# Altium schematic sheet Sheet1.SchDoc
size A4
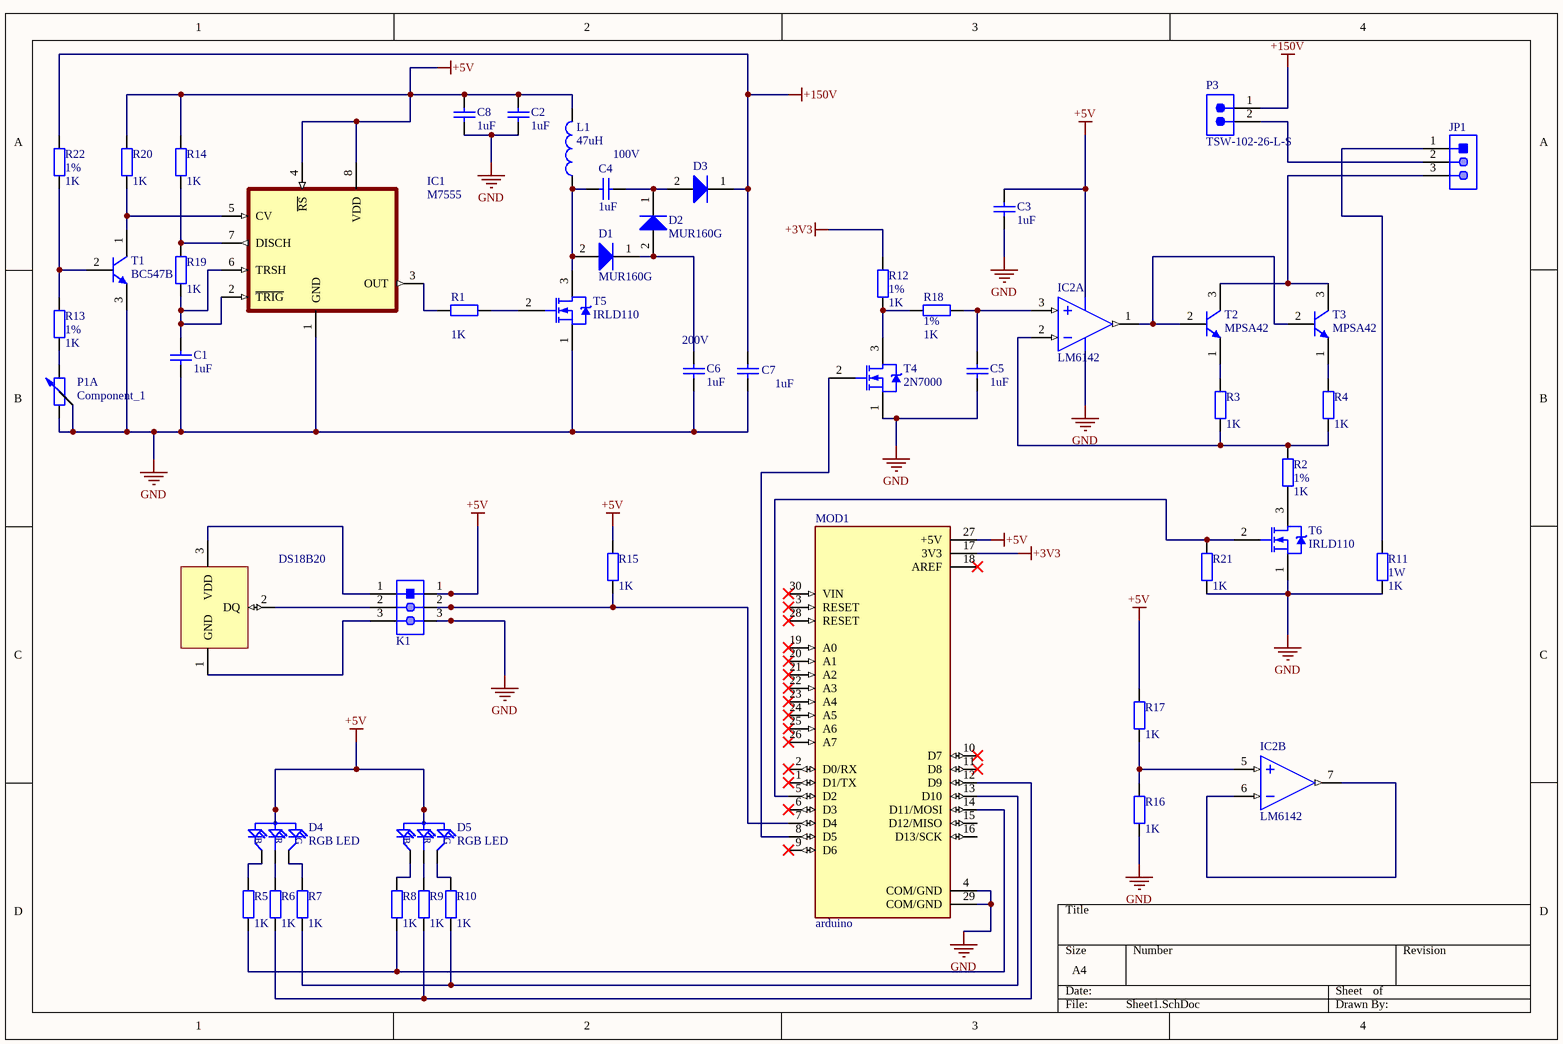
[diagram p0: Sheet1.SchDoc]

## Parts
C1  value 1uF  [RAD-0.3]  (hidden comment: Cap)
C2  value 1uF  [RAD-0.3]  (hidden comment: Cap)
C3  value 1uF  [RAD-0.3]  (hidden comment: Cap)
C4  100V  value 1uF  [Ceramic Capacitor]
C5  value 1uF  [RAD-0.3]  (hidden comment: Cap)
C6  200V  value 1uF  [electrolytic capacitor 2.2uf]
C7  value 1uF  [electrolytic capacitor 2.2uf]  (hidden comment: 200V)
C8  value 1uF  [RAD-0.3]  (hidden comment: Cap)
D1  MUR160G  [MUR160G]
D2  MUR160G  [MUR160G]
D3  MUR160G  [MUR160G]  (value not drawn)
D4  RGB LED
D5  RGB LED
DS18B20  DS18B20+  [Q3+1]  (value not drawn)
IC1  M7555  [M7555]
IC2  LM6142  [LM6142]  (parts A,B of 2)
JP1  22-28-4033  [MOLX-22-28-4033_V]  (value not drawn)
K1  61900319521  [K1]  (value not drawn)
L1  value 47uH  [ELC08D470E]  (hidden comment: Inductor)
MOD1  arduino
P1  Component_1  (part A of 2)
P3  TSW-102-26-L-S  [SMTC-TSW-102-26-XX-S]
R1  value 1K  [Resistor]  (hidden comment: 1%)
R2  1%  value 1K  [SMD resistor]
R3  value 1K  [SMD resistor]  (hidden comment: Res2)
R4  value 1K  [SMD resistor]  (hidden comment: Res2)
R5  value 1K  [Resistor]  (hidden comment: Res2)
R6  value 1K  [Resistor]  (hidden comment: Res2)
R7  value 1K  [Resistor]  (hidden comment: Res2)
R8  value 1K  [Resistor]  (hidden comment: Res2)
R9  value 1K  [Resistor]  (hidden comment: Res2)
R10  value 1K  [Resistor]  (hidden comment: Res2)
R11  1W  value 1K  [RESISTOR 1W]
R12  1%  value 1K  [SMD resistor]
R13  1%  value 1K  [Resistor]
R14  value 1K  [Resistor]  (hidden comment: Res2)
R15  value 1K  [Resistor]  (hidden comment: Res2)
R16  value 1K  [SMD resistor]  (hidden comment: 1%)
R17  value 1K  [SMD resistor]  (hidden comment: 1%)
R18  1%  value 1K  [SMD resistor]
R19  value 1K  [Resistor]  (hidden comment: Res2)
R20  value 1K  [Resistor]  (hidden comment: Res2)
R21  value 1K  [SMD resistor]  (hidden comment: 1%)
R22  1%  value 1K  [Resistor]
T1  BC547B  [BC547B]
T2  MPSA42  [BC547B]
T3  MPSA42  [BC547B]
T4  2N7000  [BC547B]
T5  IRLD110
T6  IRLD110

## Nets
+3V3: MOD1.17(3V3) R12.2
+5V: C2.2 C3.2 C8.2 D4.C(POS) D5.C(POS) IC1.4(~{RS}) IC1.8(VDD) K1.1 L1.2 MOD1.27(+5V) R14.2 R15.2 R17.2 R20.2
+150V: C7.2 D3.1(K) P3.1 R22.2
GND: C1.1 C2.1 C3.1 C5.1 C6.1 C7.1 C8.1 IC1.1(GND) K1.3 MOD1.4(COM/GND) MOD1.29(COM/GND) P1.1 P1.3 R11.1 R16.1 R21.1 T1.3(E) T4.1(S) T5.1(S) T6.1(S)
NetC1_2: C1.2 IC1.2(~{TRIG}) IC1.6(TRSH) R19.1
NetC4_1: C4.1 D2.1(K) D3.2(A)
NetC4_2: C4.2 D1.2(A) L1.1 T5.3(D)
NetC5_2: C5.2 IC2.3(INA+) R18.2
NetC6_2: C6.2 D1.1(K) D2.2(A)
NetD4_B: D4.B R5.2
NetD4_G: D4.G R7.2
NetD4_R: D4.R R6.2
NetD5_B: D5.B R8.2
NetD5_G: D5.G R10.2
NetD5_R: D5.R R9.2
NetDS18B20_1: DS18B20.1(GND) K1.3
NetDS18B20_2: DS18B20.2(DQ) K1.2
NetDS18B20_3: DS18B20.3(VDD) K1.1
NetIC1_3: IC1.3(OUT) R1.1
NetIC1_5: IC1.5(CV) R20.1 T1.1(C)
NetIC1_7: IC1.7(DISCH) R14.1 R19.2
NetIC2_1: IC2.1(OUTA) T2.2(B) T3.2(B)
NetIC2_2: IC2.2(INA-) R2.2 R3.1 R4.1
NetIC2_5: IC2.5(INB+) R16.2 R17.1
NetIC2_6: IC2.6(INB-) IC2.7(OUTB)
NetJP1_1: JP1.1 R11.2
NetJP1_2: JP1.2 P3.2
NetJP1_3: JP1.3 T2.3(C) T3.3(C)
NetK1_2: K1.2 MOD1.7(D4) R15.1
NetMOD1_5: MOD1.5(D2) R21.2 T6.2(G)
NetMOD1_8: MOD1.8(D5) T4.2(G)
NetMOD1_12: MOD1.12(D9) R6.1 R9.1
NetMOD1_13: MOD1.13(D10) R7.1 R10.1
NetMOD1_14: MOD1.14(D11/MOSI) R5.1 R8.1
NetP1_2: P1.2 R13.1
NetR1_2: R1.2 T5.2(G)
NetR2_1: R2.1 T6.3(D)
NetR3_2: R3.2 T2.1(E)
NetR4_2: R4.2 T3.1(E)
NetR12_1: R12.1 R18.1 T4.3(D)
NetR13_2: R13.2 R22.1 T1.2(B)

Not connected (* = marked no-connect by the designer): MOD1 1(D1/TX)* 2(D0/RX)* 3(RESET)* 6(D3)* 9(D6)* 10(D7)* 11(D8)* 15(D12/MISO) 16(D13/SCK) 18(AREF)* 19(A0)* 20(A1)* 21(A2)* 22(A3)* 23(A4)* 24(A5)* 25(A6)* 26(A7)* 28(RESET)* 30(VIN)*

## Library data of the parts
C1-C5 C8 = Capacitor: Published: 8-Jun-2000; LatestRevisionDate: 17-Jul-2002; LatestRevisionNote: Re-released for DXP Platform.; PackageReference: RAD-0.3; Publisher: Altium Limited; PackageDescription: Radial Cap, Thru-Hole; 2 Leads; 0.3 in Pin Spacing
C6 C7 = C1uF: Capacitor; Published: 8-Jun-2000; LatestRevisionDate: 17-Jul-2002; LatestRevisionNote: Re-released for DXP Platform.; PackageReference: RAD-0.3; Publisher: Altium Limited; PackageDescription: Radial Cap, Thru-Hole; 2 Leads; 0.3 in Pin Spacing
D1-D3 = Diode: Manufacturer: ON Semiconductor; Packing: Bulk Bag; IFSM Max (A): 35; VRRM Max (V): 600; Type: Ultrafast; PackageVersion: Rev. U, 02/2005; PackageDescription: 2-Pin, Axial Lead, Diameter 2.35 mm; RoHS: TRUE; ComponentLink3Description: Package Specification; ComponentLink3URL: http://www.onsemi.cn/pub_link/Collateral/59-10.PDF; ComponentLink1URL: http://www.onsemi.com/; ComponentLink1Description: Manufacturer URL; ComponentLink2Description: Datasheet; ComponentLink2URL: http://www.onsemi.com/pub_link/Collateral/MUR120-D.PDF; PackageReference: AXIAL_LEAD-2-59-10; Mounting Technology: Through Hole; PartNumber: MUR160G; DatasheetVersion: Rev. 12; Manufacturer Part Number: MUR160G
DS18B20 = DS18B20+: IC; Manufacturer: Maxim; ComponentLink2URL: http://datasheets.maxim-ic.com/en/ds/DS18B20.pdf; PackageReference: Q3+1; ComponentLink1Description: Manufacturer URL; PackageDescription: TO-92 Package, Body Dia. 4.7mm; Leads 0.51 x 0.51 mm (max), Pb-Free; DatasheetVersion: 2007; Code_JEDEC: TO-226-AA; ComponentLink1URL: http://www.maxim-ic.com; PackageVersion: revB, 2009; ComponentLink2Description: Datasheet; Manufacturer Part Number: DS18B20+
IC1 = M7555: IC; Manufacturer: Intersil; Manufacturer Part Number: ICM7555CBAZ-T; MF: Renesas Electronics; MP: ICM7555CBAZ; Frequency: 1MHz; Operating Supply Current: 60uA; Min Supply Voltage: 2V; Number of Timers/Counters: 1; High Level Output Current: -800uA; Low Level Output Current: 20mA; Max Supply Voltage: 18V; Package: SOIC-8 Intersil; Price: None; SnapEDA_Link: https://www.snapeda.com/parts/ICM7555CBAZ/Renesas%20Electronics%20America%20Inc./view-part/931/?ref=snap; Availability: Unavailable; Value: *; Supplier 1: Avnet; Supplier Part Number 1: ICM7555CBAZ-T; RoHS: Yes; Category: Clock and Timing; Pricing 1: 2500=0,25401, 5000=0,24643, 10000=0,23930, 15000=0,23256, 25000=0,22947 (USD); Mount: Surface Mount; Case/Package: SOIC; Number of Pins: 8; Contact Plating: Tin,Matte; Min Operating Temperature: 0°C; Max Operating Temperature: 70°C; Packaging: Tape and Reel; Package Quantity: 2500; Radiation Hardening: No; Lead Free: Lead Free; ComponentLink1URL: https://datasheet.ciiva.com/6667/fn2867-6667943.pdf?src-supplier=Digi-Key; ComponentLink1Description: https://datasheet.ciiva.com/6667/fn2867-6667943.pdf?src-supplier=Digi-Key; ComponentLink2URL: https://datasheet.ciiva.com/6667/fn2867-6667945.pdf?src-supplier=Digi-Key; ComponentLink2Description: https://datasheet.ciiva.com/6667/fn2867-6667945.pdf?src-supplier=Digi-Key; ComponentLink3URL: https://datasheet.ciiva.com/6667/fn2867-6667947.pdf?src-supplier=Digi-Key; ComponentLink3Description: https://datasheet.ciiva.com/6667/fn2867-6667947.pdf?src-supplier=Digi-Key
IC2 = LM6412: IC; Manufacturer: TI National Semiconductor; Manufacturer Part Number: LM6142AIM; PowerWise: N; CompType: Amplifiers; PackageTopMarking: NSZXTT*LM614*2AIM; PinCount: 8; Package Reference: D0008A; Code_IPC: SOIC127P600-8; PackageDescription: SOIC Narrow, 4.9 x 3.9 x 1.45mm, 8 Lead, 1.27mm Pitch; ComponentLink1URL: http://www.ti.com/general/docs/lit/getliterature.tsp?genericPartNumber=LM6142&fileType=pdf; Code_JEDEC: MS-012-AA; RoHS: N; ComponentLink1Description: Datasheet URL
JP1 = CMP-1676-00001-5: Male Header, Pitch 2.54 mm, 1 x 3 Position, Height 8.38 mm, Tail Length 3.18 mm, RoHS, Bulk; Manufacturer: Molex; Rows: 1; Voltage Rating: 250 V; Current Rating: 4 A; Min Operating Temperature: 0 degC; Lead Pitch: 0.1 inch; Packaging: Bulk; Contact Finish: Gold; RoHSCompliant: true; Contact Material: Brass; PackageReference: 22-28-4033; REACH SVHC: Unknown; PackageDescription: Male Header, Pitch 2.54 mm, 1 x 3 Position, Height 8.38 mm, Tail Length 3.18 mm; ComponentLink2URL: http://www.molex.com/pdm_docs/sd/022284033_sd.pdf; Height: 8.38 mm; Mounting Technology: Through Hole; ComponentLink1Description: Manufacturer URL; Length: 7.62 mm; Mount: Through Hole; DatasheetVersion: Rev. G, 01/2012; Max Operating Temperature: 75 degC; ComponentLink2Description: Datasheet; Colour: Black; Pins: 3; Contact Plating: Gold; Package Quantity: 1; ComponentLink1URL: http://www.molex.com/
K1 = K1: Connector; Manufacturer: Wurth Electronics; Working Voltage: 250VAC; Pitch: 2.54mm; Position: 1x3; Gender: Male; Contact Resistance: 20mOhm; Package Reference: 61900319521; Manufacturer URL: http://www.we-online.de; Orientation: RightAngled; Operating Temperature: -40to105degC; Publisher: WurthElektronik; Packaging: Bag; Datasheet URL: https://katalog.we-online.de/em/datasheet/6190xx19521.pdf; Mounting Technology: THT; Part Number: 61900319521; Manufacturer Part Number: 61900319521
L1 = Inductor: Code_IEC: 1005; Published: 8-Jun-2000; LatestRevisionDate: 29-May-2009; LatestRevisionNote: IPC-7351 Footprint Added.; PackageReference: 0402-A; Publisher: Altium Limited; PackageDescription: Chip Inductor; Code_JEITA: 0402
MOD1 = arduino: Arduino nano
P3 = CMP-1024-00330-1: 0.025" SQ Post Header, Through-hole, Vertical, -55 to 125 degC, 2.54 mm Pitch, 2-Pin, Male, RoHS; Manufacturer: Samtec; Pitch: 2.54 mm; DatasheetVersion: F-214; PackageReference: TSW-102-26-XX-S; ComponentLink3Description: Package Specification; PackageDescription: .025[0.64] SQ. Post Terminal Strip Assembly; PackageVersion: DM, 8/1988; ComponentLink1Description: Manufacturer URL; ComponentLink2URL: http://www.samtec.com/documents/webfiles/pdf/TSW_TH.PDF; ComponentLink3URL: http://www.samtec.com/documents/webfiles/cpdf/TSW-XXX-XX-XXX-X-XX-XXX-MKT.pdf; ComponentLink2Description: Datasheet; Temperature Range: -55 to 125 degC; Mounting Technology: Through-hole; ComponentLink1URL: http://www.samtec.com; RoHS: True; PartNumber: TSW-102-26-L-S; Orientation: Vertical
R1 R11 R12 R16-R18 R21 R22 = Resistor: Published: 8-Jun-2000; LatestRevisionDate: 17-Jul-2002; LatestRevisionNote: Re-released for DXP Platform.; PackageReference: AXIAL-0.4; Publisher: Altium Limited; PackageDescription: Axial Device, Thru-Hole; 2 Leads; 0.4 in Pin Spacing
R2-R10 R13-R15 R19 R20 = Res2: Resistor; Published: 8-Jun-2000; LatestRevisionDate: 17-Jul-2002; LatestRevisionNote: Re-released for DXP Platform.; PackageReference: AXIAL-0.4; Publisher: Altium Limited; PackageDescription: Axial Device, Thru-Hole; 2 Leads; 0.4 in Pin Spacing
T1 = BC547B: Transistor; Manufacturer: ON Semiconductor / Fairchild; Polarity: NPN; Packing: Bulk Box; IC Continuous (A): 0.1; fT Min (MHz): 150; DatasheetVersion: Rev. 7; ComponentLink1URL: http://www.onsemi.com/; RoHS: FALSE; ComponentLink1Description: Manufacturer URL; PackageDescription: 3-Pin Transistor Outline, Body 4.825 x 3.685 mm, Pitch 1.27 mm; ComponentLink3URL: http://www.onsemi.cn/pub_link/Collateral/2N6426-D.PDF; ComponentLink2Description: Datasheet; PackageVersion: Rev. AM; PackageReference: TO-92-3-29-11_AM_SL; ComponentLink3Description: Package Specification; Mounting Technology: Through Hole; PartNumber: BC547B; ComponentLink2URL: http://www.onsemi.com/pub_link/Collateral/BC546-D.PDF; Manufacturer Part Number: BC547B
T2 T3 = MPSA42: Transistor; Manufacturer: ON Semiconductor / Fairchild; fT Min (MHz): 50; Packing: Bulk Box; Note1: 0; IC Continuous (A): 0.5; Polarity: NPN; ComponentLink3Description: Package Specification; PackageReference: TO-92-3-29-11_AM_SL; ComponentLink1URL: http://www.onsemi.com/; PackageDescription: 3-Pin Transistor Outline, Body 4.825 x 3.685 mm, Pitch 1.27 mm; Mounting Technology: Through Hole; RoHS: FALSE; DatasheetVersion: Rev. 8; PackageVersion: Rev. AM; ComponentLink2Description: Datasheet; ComponentLink1Description: Manufacturer URL; ComponentLink2URL: http://www.onsemi.cn/pub_link/Collateral/MPSA42-D.PDF; ComponentLink3URL: http://www.onsemi.cn/pub_link/Collateral/2N6426-D.PDF; PartNumber: MPSA42; Manufacturer Part Number: MPSA42
T4 = IC2N7000: Transistor; Manufacturer: ON Semiconductor / Fairchild; Ciss Typ (pF): 60; VGS(th) Max (V): 3; Crss Typ (pF): 5; Channel Polarity: N Channel; VGS Max (V): 20; Configuration: Single; PD Max (W): 0.35; Coss Typ (pF): 25; Packing: Bulk Box; ID Max (A): 0.2; PackageVersion: Rev. AM; ComponentLink3URL: http://www.onsemi.cn/pub_link/Collateral/2N6426-D.PDF; ComponentLink2URL: http://www.onsemi.com/pub_link/Collateral/2N7000-D.PDF; DatasheetVersion: Rev. 8; Mounting Technology: Through Hole; V(BR)DSS Min (V): 60; PartNumber: 2N7000; PackageDescription: 3-Pin Transistor Outline, Body 4.825 x 3.685 mm, Pitch 1.27 mm; ComponentLink2Description: Datasheet; ComponentLink1URL: http://www.onsemi.com/; PackageReference: TO-92-3-29-11_AM_SL; ComponentLink1Description: Manufacturer URL; Package Type: TO-92; ComponentLink3Description: Package Specification; Manufacturer Part Number: 2N7000
T5 T6 = IRLD110: Transistor; Supplier 1: Digi-Key; Supplier Part Number 1: IRLD110PBF-ND